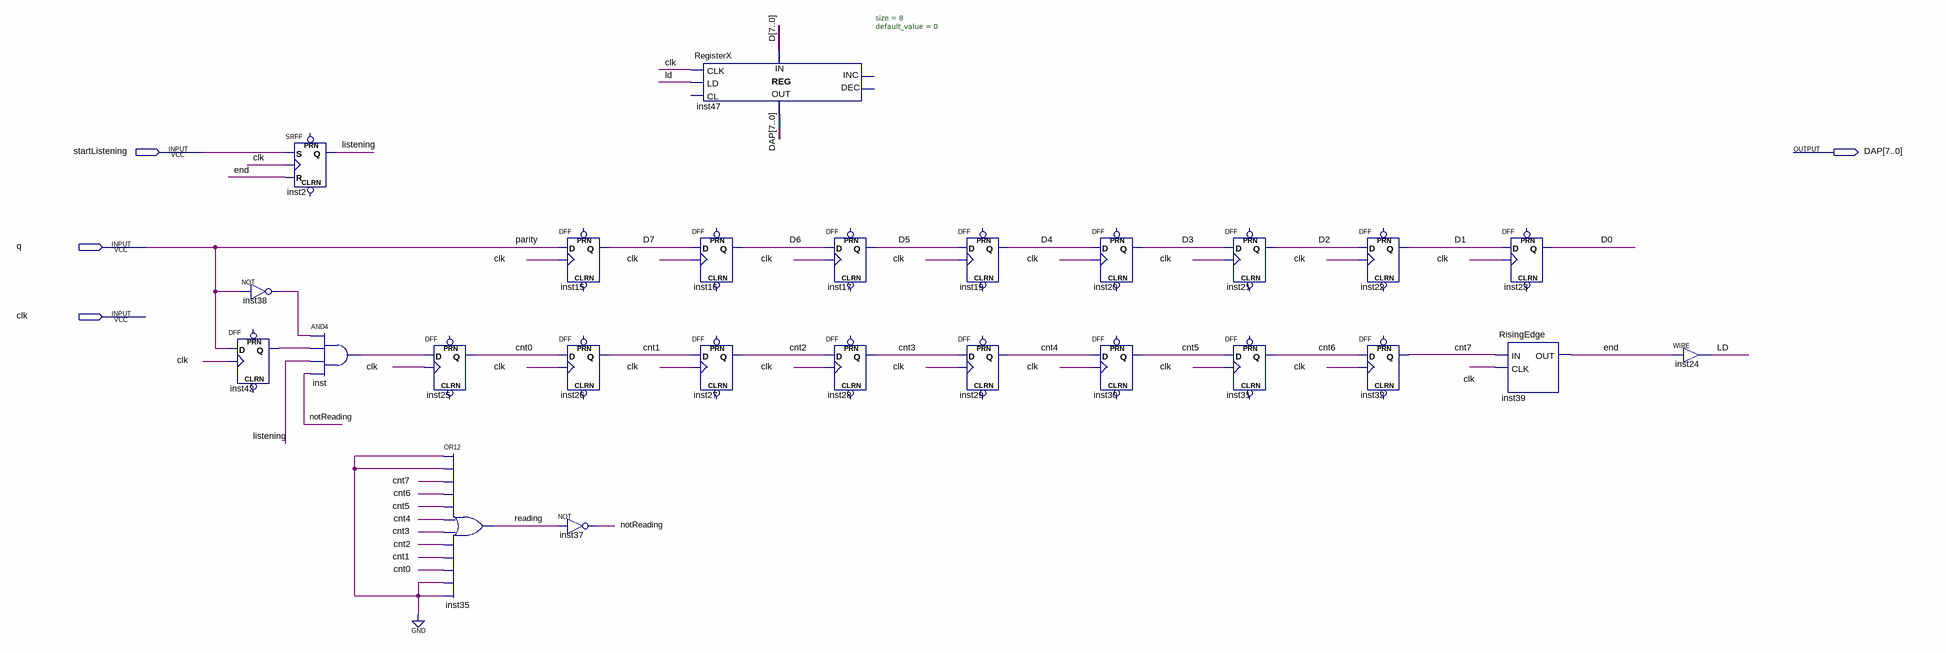
[diagram p0: schematic sheet]
// Quartus schematic waitforresponse.bdf as structural Verilog: 25 symbols, 4 pins
module waitforresponse (
  input  startListening,
  input  q,
  input  clk,
  output [7:0] DAP
);

  wire cnt0, cnt1, cnt2, cnt3, cnt4, cnt5, cnt6, cnt7, \end , inst38_out, inst42_q, inst_out, LD, listening,
       notReading, reading;
  wire [7:0] D;

  not inst38 (inst38_out, q);
  DFF inst42 (.CLK(clk), .D(q), .Q(inst42_q));  // open: CLRN, PRN
  SRFF inst2 (.S(startListening), .R(\end ), .CLK(clk), .Q(listening));  // open: PRN, CLRN
  and inst (inst_out, inst38_out, inst42_q, listening, notReading);
  DFF inst25 (.CLK(clk), .D(inst_out), .Q(cnt0));  // open: CLRN, PRN
  or inst35 (reading, 1'b0, 1'b0, cnt7, cnt6, cnt5, cnt4, cnt3, cnt2, cnt1, cnt0, 1'b0, 1'b0);
  DFF inst15 (.CLK(clk), .D(q), .Q(D[7]));  // open: CLRN, PRN
  DFF inst26 (.CLK(clk), .D(cnt0), .Q(cnt1));  // open: CLRN, PRN
  not inst37 (notReading, reading);
  RegisterX #(.size(8), .default_value(0)) inst47 (
    .CLK(clk), .LD(LD), .DATA_IN(D), .DATA_OUT(DAP));  // open: CL, INC, DEC
  DFF inst16 (.CLK(clk), .D(D[7]), .Q(D[6]));  // open: CLRN, PRN
  DFF inst27 (.CLK(clk), .D(cnt1), .Q(cnt2));  // open: CLRN, PRN
  DFF inst17 (.CLK(clk), .D(D[6]), .Q(D[5]));  // open: CLRN, PRN
  DFF inst28 (.CLK(clk), .D(cnt2), .Q(cnt3));  // open: CLRN, PRN
  DFF inst19 (.CLK(clk), .D(D[5]), .Q(D[4]));  // open: CLRN, PRN
  DFF inst29 (.CLK(clk), .D(cnt3), .Q(cnt4));  // open: CLRN, PRN
  DFF inst20 (.CLK(clk), .D(D[4]), .Q(D[3]));  // open: CLRN, PRN
  DFF inst30 (.CLK(clk), .D(cnt4), .Q(cnt5));  // open: CLRN, PRN
  DFF inst21 (.CLK(clk), .D(D[3]), .Q(D[2]));  // open: CLRN, PRN
  DFF inst31 (.CLK(clk), .D(cnt5), .Q(cnt6));  // open: CLRN, PRN
  DFF inst22 (.CLK(clk), .D(D[2]), .Q(D[1]));  // open: CLRN, PRN
  DFF inst32 (.CLK(clk), .D(cnt6), .Q(cnt7));  // open: CLRN, PRN
  DFF inst23 (.CLK(clk), .D(D[1]), .Q(D[0]));  // open: CLRN, PRN
  RisingEdge inst39 (.IN(cnt7), .CLK(clk), .OUT(\end ));
  assign LD = \end ;  // WIRE inst24

  // Other names for the same wires on the sheet: parity = q
endmodule
